# EAGLE design esquema_primeiraVersao (EAGLE 9.6.2)
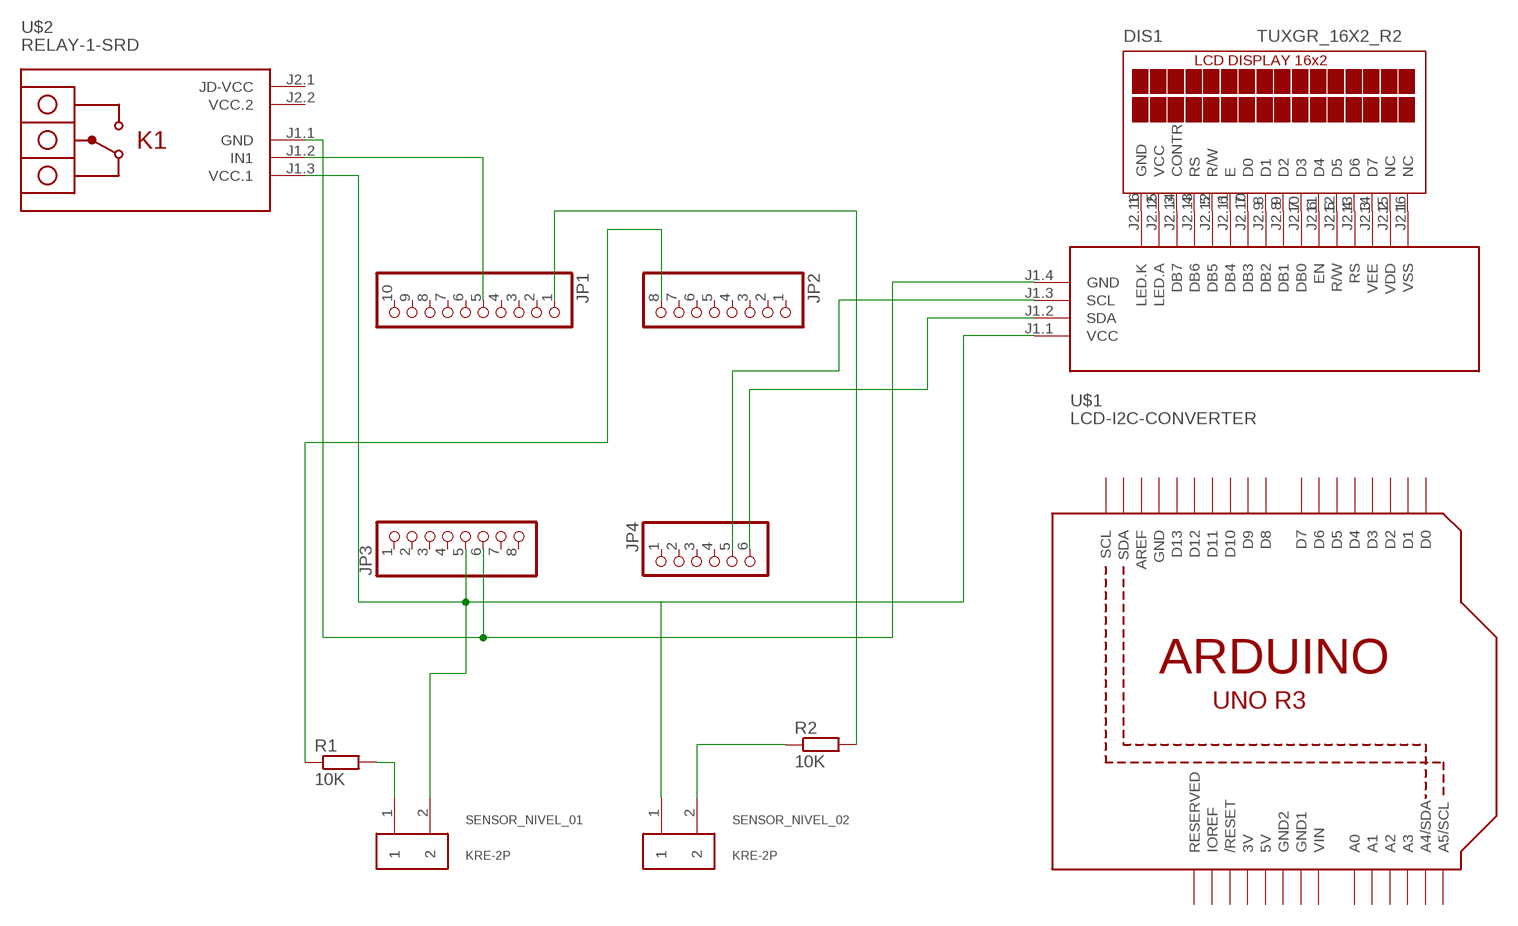
[diagram p0: schematic, sheet 1]

## Parts
DIS1  TUXGR_16X2_R2  [TUXGR_16X2_R2]
JP1  PINHD-1X10  [1X10]
JP2  PINHD-1X8  [1X08]
JP3  PINHD-1X8  [1X08]
JP4  PINHD-1X6  [1X06]
R1  10K  R-EU_0204/5  [0204/5]
R2  10K  R-EU_0204/5  [0204/5]
SENSOR_NIVEL_01  KRE-2P  [KRE-2P]
SENSOR_NIVEL_02  KRE-2P  [KRE-2P]
U1  ARDUINOR3-BPLACE  [ARDUINOR3-BPLACE]
U$1  LCD-I2C-CONVERTER  [LCD-I2C-CONVERTER]
U$2  RELAY-1-SRD  [RELAY-1-SRD]

## Nets
N$1: DIS1.1(GND) U$1.J2.16(LED.K)
N$2: DIS1.2(VCC) U$1.J2.15(LED.A)
N$3: DIS1.3(CONTR) U$1.J2.14(DB7)
N$4: DIS1.4(RS) U$1.J2.13(DB6)
N$5: DIS1.5(R/W) U$1.J2.12(DB5)
N$6: DIS1.6(E) U$1.J2.11(DB4)
N$7: DIS1.7(D0) U$1.J2.10(DB3)
N$8: DIS1.8(D1) U$1.J2.9(DB2)
N$9: DIS1.9(D2) U$1.J2.8(DB1)
N$10: DIS1.10(D3) U$1.J2.7(DB0)
N$11: DIS1.11(D4) U$1.J2.6(EN)
N$12: DIS1.12(D5) U$1.J2.5(R/W)
N$13: DIS1.13(D6) U$1.J2.4(RS)
N$14: DIS1.14(D7) U$1.J2.3(VEE)
N$15: DIS1.15(NC) U$1.J2.2(VDD)
N$16: DIS1.16(NC) U$1.J2.1(VSS)
N$17: JP2.8 R1.1
N$18: R1.2 SENSOR_NIVEL_01.1
N$19: JP3.5 SENSOR_NIVEL_01.2 SENSOR_NIVEL_02.1 U$1.J1.1(VCC) U$2.J1.3(VCC.1)
N$20: R2.1 SENSOR_NIVEL_02.2
N$21: JP1.1 R2.2
N$22: JP1.5 U$2.J1.2(IN1)
N$23: JP3.6 U$1.J1.4(GND) U$2.J1.1(GND)
N$26: JP4.6 U$1.J1.2(SDA)
N$27: JP4.5 U$1.J1.3(SCL)
Unconnected: JP1.2 JP1.3 JP1.4 JP1.6 JP1.7 JP1.8 JP1.9 JP1.10 JP2.1 JP2.2 JP2.3 JP2.4 JP2.5 JP2.6 JP2.7 JP3.1 JP3.2 JP3.3 JP3.4 JP3.7 JP3.8 JP4.1 JP4.2 JP4.3 JP4.4 U1.A0 U1.A1 U1.A2 U1.A3 U1.A4(A4/SDA) U1.A5(A5/SCL) U1.AREF U1.D0 U1.D1 U1.D2 U1.D3 U1.D4 U1.D5 U1.D6 U1.D7 U1.D8 U1.D9 U1.D10 U1.D11 U1.D12 U1.D13 U1.IOREF U1.RESERVED U1.RESET(/RESET) U1.SCL U1.SDA U$2.J2.1(JD-VCC)

## Power pins joined to a net without a drawn wire
3V: U1.3V
5V: U1.5V
GND: U1.GND
GND1: U1.GND1
GND2: U1.GND2
VCC.2: U$2.J2.2(VCC.2)
VIN: U1.VIN

## Library data of the parts
DIS1 = display-lcd:TUXGR_16X2_R2: Tuxgraphics LCD display 16x2 characters reflective, without background light Source: tuxgr_12x2_r2.pdf; OC_FARNELL: unknown; OC_NEWARK: unknown
JP1 = pinhead:PINHD-1X10: PIN HEADER
JP2 JP3 = pinhead:PINHD-1X8: PIN HEADER
JP4 = pinhead:PINHD-1X6: PIN HEADER
R1 R2 = rcl:R-EU_: RESISTOR, European symbol; SPICEPREFIX: R
SENSOR_NIVEL_01 SENSOR_NIVEL_02 = kre:KRE-2P: KRE Conector 2P
U1 = adafruit:ARDUINOR3: This is a new object for the new Arduino R3 - with extra pins that you may want to use (such as IOref, and duplicated A4/A5
U$1 = diy-modules:LCD-I2C-CONVERTER: I2C Bus to 4-Bit Parallel LCD Interface with LED backlight driver
U$2 = diy-modules:RELAY-1-SRD: 1-Channel Relay Module based on SRD-05VDC-SL-C relays Click here to find device on ebay.com <http://www.ebay.com/sch/one+channel+isolated+relay+5v>

## Board
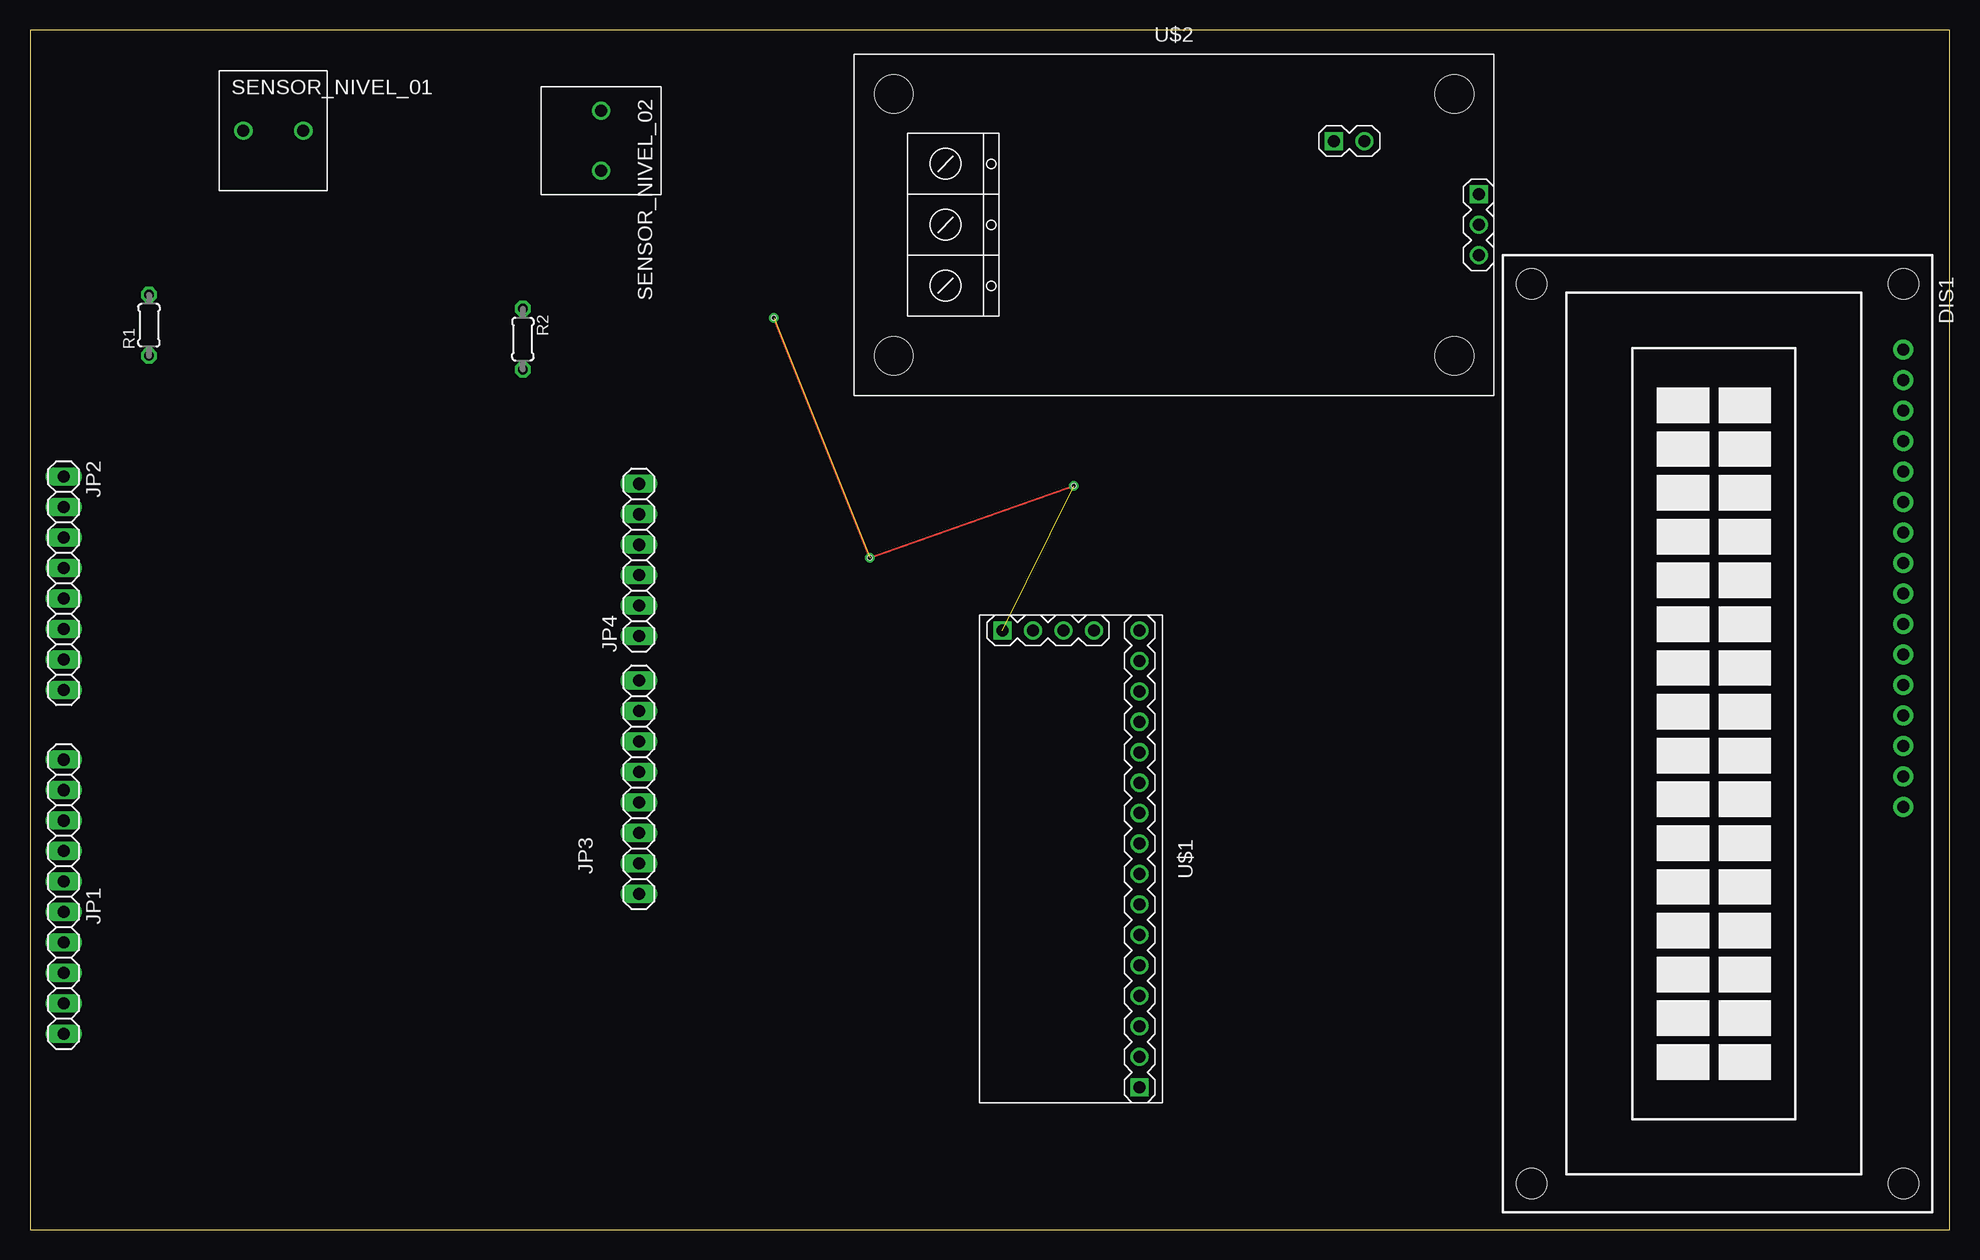
[diagram p1: board, top side]
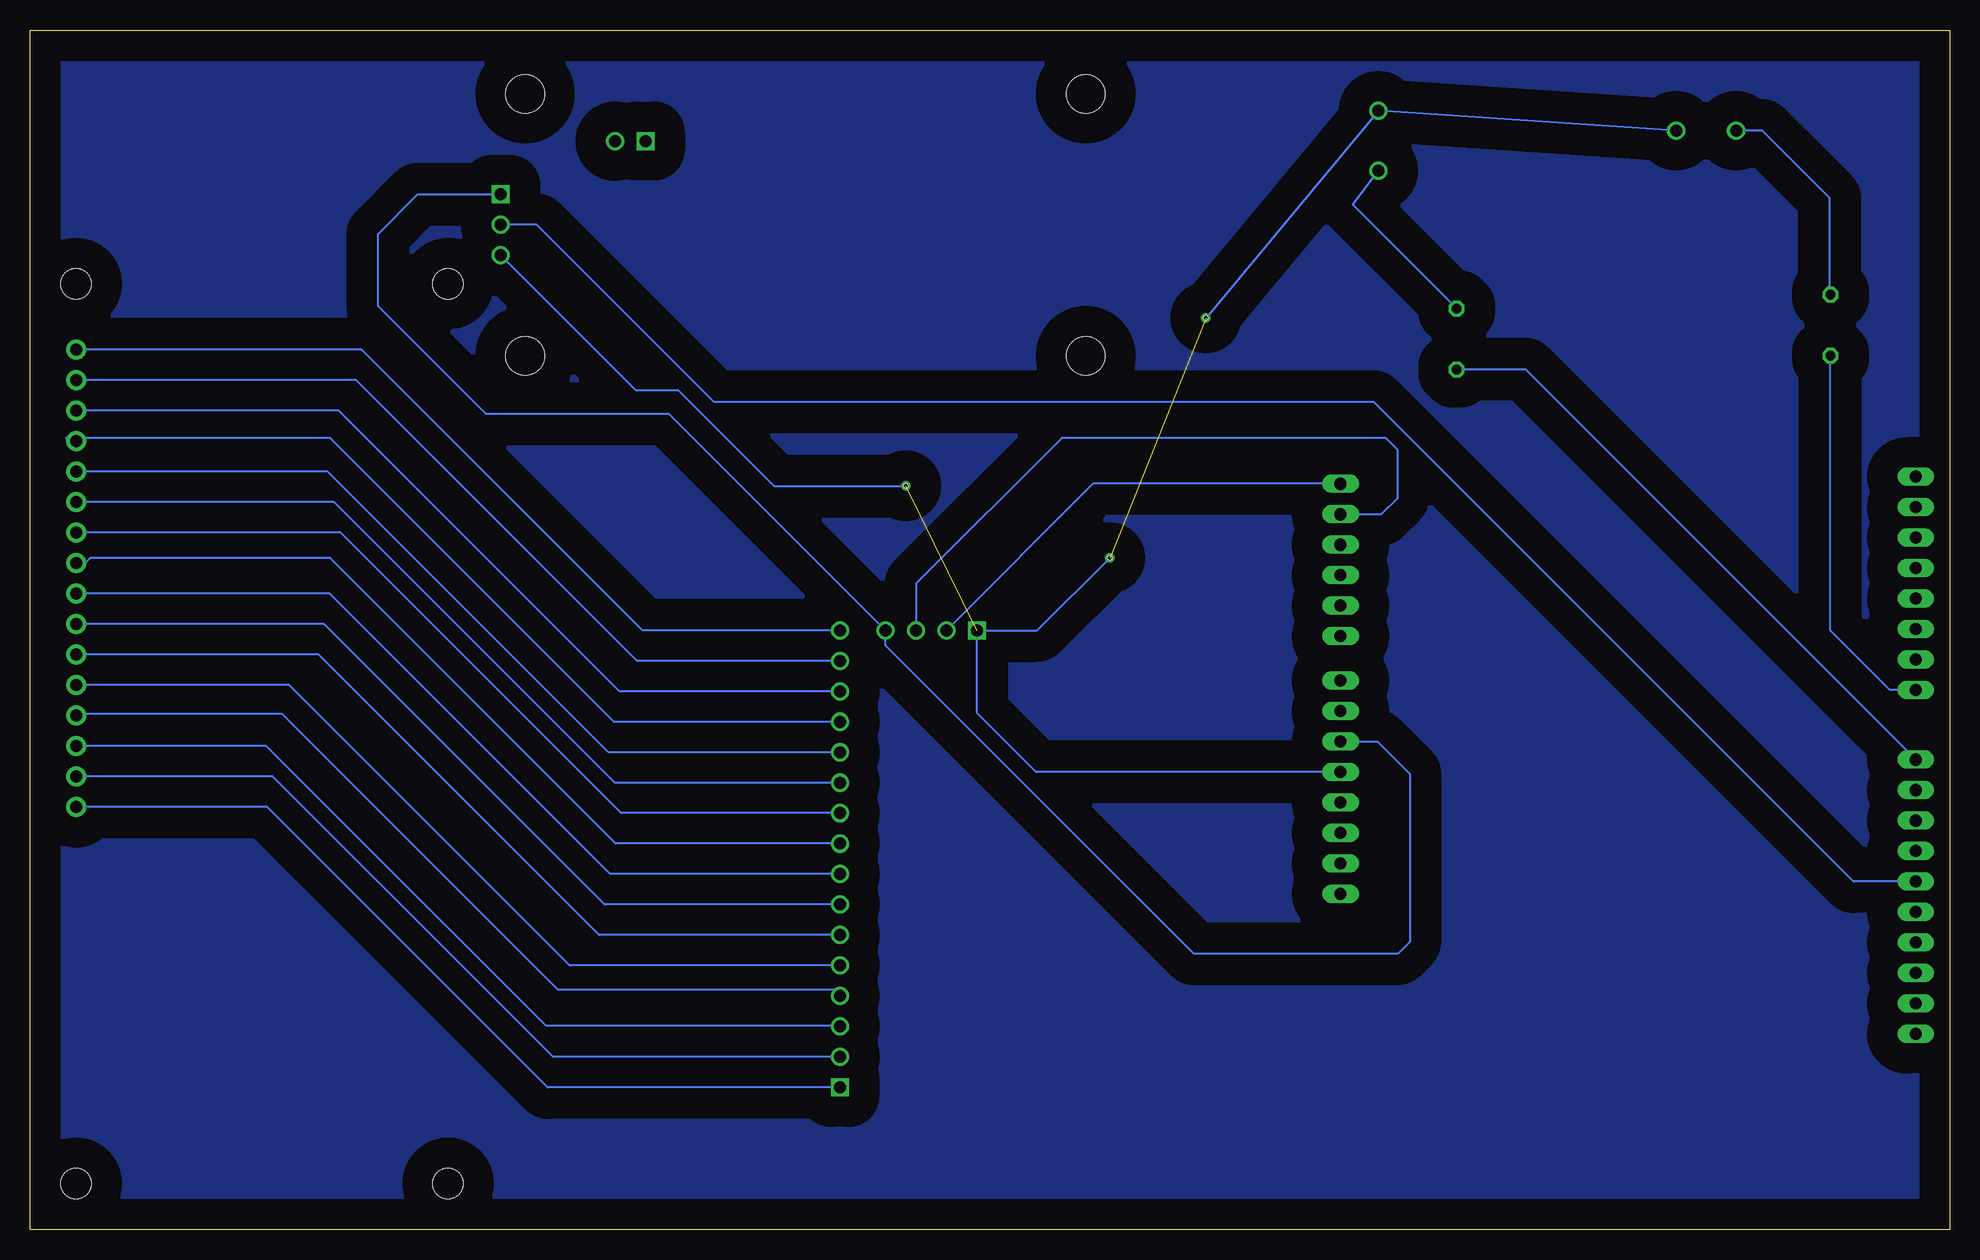
[diagram p2: board, bottom side, seen from below]

Size 160 x 100 mm. Coordinates in mm from the lower left corner, seen from the top.
Outline: 0,0 160,0 160,100 0,100 0,0
Copper layers (1*16): Top 0.035mm / dielectric 1.5mm / Bottom 0.035mm
Design rules "default": minimum track width 6mil, minimum drill 0.35mm, track to track 6mil, track to pad 6mil, pad to pad 6mil, via to via 6mil, smd to smd 6mil, copper to edge 40mil, drill to drill 6mil, minimum pad ring 10mil, minimum via ring 8mil, stop-mask expansion 4mil, vias tented up to drill 0mil, thermal gap 10mil
Holes 0.35 mm at 70,56 87,62 62,76

### Footprints (pad centres in the part's own frame; a part is rotated, then mirrored left to right if it is on the bottom)
TUXGR_16X2_R2 = drill 1 pad 1.676: 1 -32,15.5; 2 -29.46,15.5; 3 -26.92,15.5; 4 -24.38,15.5; 5 -21.84,15.5; 6 -19.3,15.5; 7 -16.76,15.5; 8 -14.22,15.5; 9 -11.68,15.5; 10 -9.14,15.5; 11 -6.6,15.5; 12 -4.06,15.5; 13 -1.52,15.5; 14 1.02,15.5; 15 3.56,15.5; 16 6.1,15.5 | hole 2.5: -37.5,-15.5; 37.5,-15.5; -37.5,15.5; 37.5,15.5
1X10 = drill 1.016 long: 1 -11.43,0; 2 -8.89,0; 3 -6.35,0; 4 -3.81,0; 5 -1.27,0; 6 1.27,0; 7 3.81,0; 8 6.35,0; 9 8.89,0; 10 11.43,0
1X08 = drill 1.016 long: 1 -8.89,0; 2 -6.35,0; 3 -3.81,0; 4 -1.27,0; 5 1.27,0; 6 3.81,0; 7 6.35,0; 8 8.89,0
1X06 = drill 1.016 long: 1 -6.35,0; 2 -3.81,0; 3 -1.27,0; 4 1.27,0; 5 3.81,0; 6 6.35,0
0204/5 = drill 0.813 octagon: 1 -2.54,0; 2 2.54,0
KRE-2P = drill 1: 1 -2.54,0; 2 2.46,0
ARDUINOR3-BPLACE = drill 1 pad 1.676 octagon: 3V 35.56,2.54; 5V 38.1,2.54; A0 50.8,2.54; A1 53.34,2.54; A2 55.88,2.54; A3 58.42,2.54; A4 60.96,2.54; A5 63.5,2.54; AREF 23.876,50.8; D0 63.5,50.8; D1 60.96,50.8; D2 58.42,50.8; D3 55.88,50.8; D4 53.34,50.8; D5 50.8,50.8; D6 48.26,50.8; D7 45.72,50.8; D8 41.656,50.8; D9 39.116,50.8; D10 36.576,50.8; D11 34.036,50.8; D12 31.496,50.8; D13 28.956,50.8; GND 26.416,50.8; GND1 43.18,2.54; GND2 40.64,2.54; IOREF 30.48,2.54; RESERVED 27.94,2.54; RESET 33.02,2.54; SCL 18.796,50.8; SDA 21.336,50.8; VIN 45.72,2.54
LCD-I2C-CONVERTER = drill 1 square: J1.1 -19.05,-5.08; J2.1 19.05,6.35 | drill 1: J1.2 -19.05,-2.54; J1.3 -19.05,0; J1.4 -19.05,2.54; J2.2 16.51,6.35; J2.3 13.97,6.35; J2.4 11.43,6.35; J2.5 8.89,6.35; J2.6 6.35,6.35; J2.7 3.81,6.35; J2.8 1.27,6.35; J2.9 -1.27,6.35; J2.10 -3.81,6.35; J2.11 -6.35,6.35; J2.12 -8.89,6.35; J2.13 -11.43,6.35; J2.14 -13.97,6.35; J2.15 -16.51,6.35; J2.16 -19.05,6.35
RELAY-1-SRD = drill 1 square: J1.1 25.4,2.54; J2.1 13.335,6.985 | drill 1: J1.2 25.4,0; J1.3 25.4,-2.54; J2.2 15.875,6.985 | hole 3.2: -23.368,10.922; 23.368,10.922; 23.368,-10.922; -23.368,-10.922

### Placement (x,y rotation side)
DIS1  140.66,41.34 270 top
JP1  2.81,27.74 270 top
JP2  2.81,53.87 270 top
JP3  50.76,36.87 90 top
JP4  50.76,55.82 90 top
R1  9.92,75.39 90 top
R2  41.08,74.23 270 top
SENSOR_NIVEL_01  20.33,91.62 0 top
SENSOR_NIVEL_02  47.62,90.72 270 top
U1  -3.27,0.72 90 top  (outside the outline)
U$1  86.14,30.9 270 top
U$2  95.36,83.76 0 top

### Tracks (layer width: path | path; a pad name or v marks a point on that pad's centre or on a via)
N$1
  Bottom 0.152: U$1.J2.16 108.95,49.95 132.34,73.34 DIS1.1
N$2
  Bottom 0.152: U$1.J2.15 109.41,47.41 132.8,70.8 DIS1.2
N$3
  Bottom 0.152: U$1.J2.14 110.87,44.87 134.26,68.26 DIS1.3
N$4
  Bottom 0.152: U$1.J2.13 111.33,42.33 135,66 157,66 156.72,65.72 DIS1.4
N$5
  Bottom 0.152: U$1.J2.12 111.79,39.79 135.18,63.18 DIS1.5
N$6
  Bottom 0.152: U$1.J2.11 111.25,37.25 134.64,60.64 DIS1.6
N$7
  Bottom 0.152: U$1.J2.10 110.71,34.71 134.1,58.1 DIS1.7
N$8
  Bottom 0.152: U$1.J2.9 111.17,32.17 135,56 155,56 156,55 156.16,55.16 DIS1.8
N$9
  Bottom 0.152: U$1.J2.8 111.63,29.63 135.02,53.02 DIS1.9
N$10
  Bottom 0.152: U$1.J2.7 112.09,27.09 135.48,50.48 DIS1.10
N$11
  Bottom 0.152: U$1.J2.6 112.55,24.55 135.94,47.94 DIS1.11
N$12
  Bottom 0.152: U$1.J2.5 115.01,22.01 138.4,45.4 DIS1.12
N$13
  Bottom 0.152: U$1.J2.4 93.02,20 116,20 139,43 156.02,43 DIS1.13
N$14
  Bottom 0.152: U$1.J2.3 92.56,17 117,17 140.32,40.32 DIS1.14
N$15
  Bottom 0.152: U$1.J2.2 116.39,14.39 139.78,37.78 DIS1.15
N$16
  Bottom 0.152: U$1.J2.1 116.85,11.85 140.24,35.24 DIS1.16
N$17
  Bottom 0.152: JP2.8 2.83,45 5,45 9.92,49.92 R1.1
N$18
  Bottom 0.152: R1.2 10,78.01 10,86 15.62,91.62 SENSOR_NIVEL_01.1
N$19  (2 unrouted)
  Bottom 0.152: JP3.5 76.14,38.14 81.06,43.06 U$1.J1.1 76.05,49.95 70,56 | SENSOR_NIVEL_01.2 SENSOR_NIVEL_02.1 62,76 | U$2.J1.3 109.54,70 106,70 98,62 87,62
N$20
  Bottom 0.152: R2.1 49.74,85.43 SENSOR_NIVEL_02.2
N$21
  Bottom 0.152: JP1.1 35.33,71.69 R2.2
N$22
  Bottom 0.152: JP1.5 7.99,29.01 8,29 48,69 103,69 117.76,83.76 U$2.J1.2
N$23
  Bottom 0.152: JP3.6 47.68,40.68 45,38 45,24 46,23 63,23 88.68,48.68 U$1.J1.4 106.73,68 122,68 131,77 131,83 127.7,86.3 U$2.J1.1
N$24  (via drill 0.35)
  Top 0.152: v70,56 62,76
N$25  (via drill 0.35)
  Top 0.152: v87,62 70,56
N$26
  Bottom 0.152: JP4.6 71.38,62.17 U$1.J1.2
N$27
  Bottom 0.152: JP4.5 47.37,59.63 46,61 46,65 47,66 74,66 86.14,53.86 U$1.J1.3
N$28  (via drill 0.35)
  other vias: 62,76
PLANE
  pour Bottom (isolate 2.54, rank 2, no thermals): 0,100 0,0 160,0 160,100